# Altium project 汉中遥控器.PrjPcb
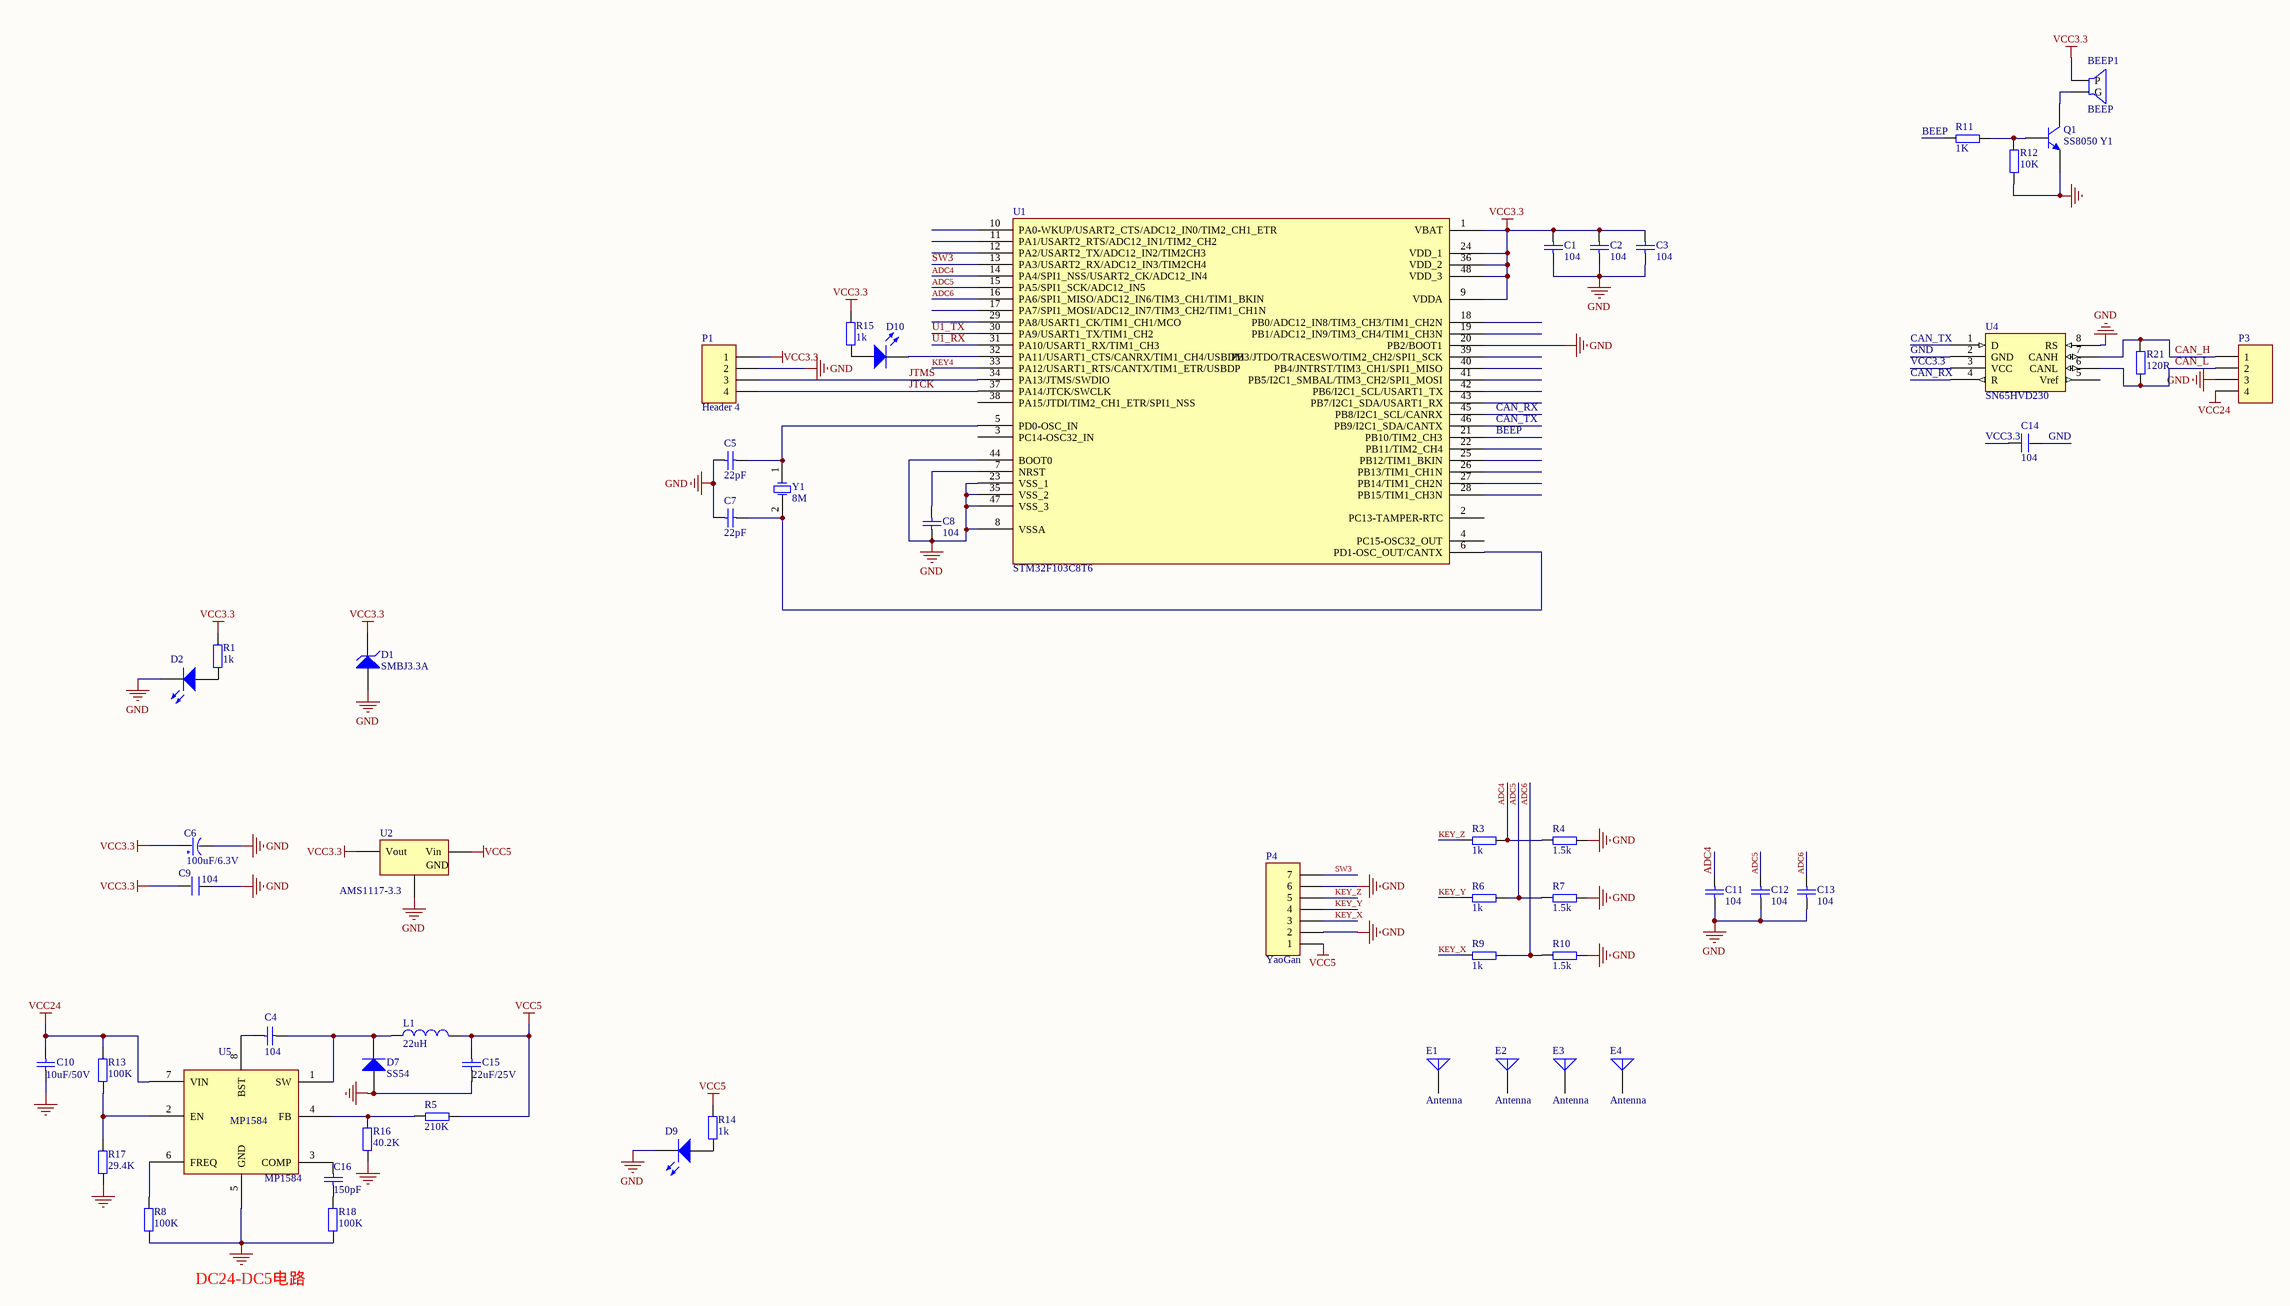
[diagram p0: Sheet2.SchDoc]
1 sheet, 54 parts. Net scope: global (net labels, ports and power ports of the same name join across sheets).
Board file: PCB2.PcbDoc

## Sheet Sheet2.SchDoc
size A2

### Parts
BEEP1  BEEP  [BELL-5]
C1  104  [0805_C]
C2  104  [0805_C]
C3  104  [0805_C]
C4  104  [0603_C]
C5  22pF  [0805_C]
C6  100uF/6.3V  [CASE-B_3528]
C7  22pF  [0805_C]
C8  104  [0805_C]
C9  104  [0805_C]
C10  10uF/50V  [1206_C]
C11  104  [0805_C]
C12  104  [0805_C]
C13  104  [0805_C]
C14  104  [0603_C]
C15  22uF/25V  [0805_C]
C16  150pF  [0603_C]
D1  SMBJ3.3A  [SMB(DO-214AA)_S1]
D2  LED0  [LC-0805_LED_S1]  (value not drawn)
D7  SS54  [SMA(DO-214AC)_S1]
D9  LED0  [LC-0805_LED_S1]  (value not drawn)
D10  LED0  [LC-0805_LED_S1]  (value not drawn)
E1  Antenna  [定位孔 Φ3.2]
E2  Antenna  [定位孔 Φ3.2]
E3  Antenna  [定位孔 Φ3.2]
E4  Antenna  [定位孔 Φ3.2]
L1  22uH  [L-7*7*4mm-S]
P1  Header 4  [IDE4]
P3  (no value)  [DZ-4-3.5]
P4  YaoGan  [XH7]
Q1  SS8050 Y1  [SOT-23(SOT-23-3)]
R1  1k  [0603_R]
R3  1k  [0603_R]
R4  1.5k  [0603_R]
R5  210K  [0603_R]
R6  1k  [0603_R]
R7  1.5k  [0603_R]
R8  100K  [0603_R]
R9  1k  [0603_R]
R10  1.5k  [0603_R]
R11  1K  [0805_R]
R12  10K  [0805_R]
R13  100K  [0603_R]
R14  1k  [0603_R]
R15  1k  [0603_R]
R16  40.2K  [0603_R]
R17  29.4K  [0603_R]
R18  100K  [0603_R]
R21  120R  [0603_R]
U1  STM32F103C8T6  [LQFP-48_7x7x05P]
U2  AMS1117-3.3  [SOT-223]
U4  SN65HVD230  [LC-SOIC-8_150mil]
U5  MP1584  [LC-SOIC-8_EP_150MIL]
Y1  8M  [XTAL_US]

### Nets
GND: C1.2 C2.2 C3.2 C5.2 C6.2(GND) C7.2 C8.2 C9.1 C10.2 C11.1 C12.2 C13.2 C14.2 C15.1 D1.1(A) D2.K D7.1(A) D9.K P1.2 P3.3 P4.2 P4.6 Q1.2(E) R4.2 R7.2 R8.2 R10.2 R12.1 R16.2 R17.2 R18.2 U1.8(VSSA) U1.20(PB2/BOOT1) U1.23(VSS_1) U1.35(VSS_2) U1.44(BOOT0) U1.47(VSS_3) U2.1(GND) U4.2(GND) U4.8(RS) U5.5(GND)
VCC3.3: BEEP1.1(P) C1.1 C2.1 C3.1 C6.1(VCC) C9.2 C14.1 D1.2(K) P1.1 R1.1 R15.1 U1.1(VBAT) U1.9(VDDA) U1.24(VDD_1) U1.36(VDD_2) U1.48(VDD_3) U2.2(Vout) U4.3(VCC)
VCC5: C15.2 L1.2 P4.1 R5.2 R14.1 U2.3(Vin)
VCC24: C10.1 P3.4 R13.1 U5.7(VIN)
ADC4: C11.2 R3.2 R4.1 U1.14(PA4/SPI1_NSS/USART2_CK/ADC12_IN4)
ADC5: C12.1 R6.2 R7.1 U1.15(PA5/SPI1_SCK/ADC12_IN5)
ADC6: C13.1 R9.2 R10.1 U1.16(PA6/SPI1_MISO/ADC12_IN6/TIM3_CH1/TIM1_BKIN)
BEEP: R11.1 U1.21(PB10/TIM2_CH3)
CAN_H: P3.1 R21.2 U4.7(CANH)
CAN_L: P3.2 R21.1 U4.6(CANL)
CAN_RX: U1.45(PB8/I2C1_SCL/CANRX) U4.4(R)
CAN_TX: U1.46(PB9/I2C1_SDA/CANTX) U4.1(D)
JTCK: P1.4 U1.37(PA14/JTCK/SWCLK)
JTMS: P1.3 U1.34(PA13/JTMS/SWDIO)
KEY4: U1.33(PA12/USART1_RTS/CANTX/TIM1_ETR/USBDP)
KEY_X: P4.3 R9.1
KEY_Y: P4.4 R6.1
KEY_Z: P4.5 R3.1
SW3: P4.7 U1.13(PA3/USART2_RX/ADC12_IN3/TIM2CH4)
U1_RX: U1.31(PA10/USART1_RX/TIM1_CH3)
U1_TX: U1.30(PA9/USART1_TX/TIM1_CH2)
NetBEEP1_2: BEEP1.2(G) Q1.3(C)
NetC4_1: C4.1 D7.2(K) L1.1 U5.1(SW)
NetC4_2: C4.2 U5.8(BST)
NetC5_1: C5.1 U1.5(PD0-OSC_IN) Y1.1(OSC1)
NetC7_1: C7.1 U1.6(PD1-OSC_OUT/CANTX) Y1.2(OSC2)
NetC8_1: C8.1 U1.7(NRST)
NetC16_1: C16.1 R18.1
NetC16_2: C16.2 U5.3(COMP)
NetD2_A: D2.A R1.2
NetD9_A: D9.A R14.2
NetD10_A: D10.A R15.2
NetD10_K: D10.K U1.32(PA11/USART1_CTS/CANRX/TIM1_CH4/USBDM)
NetQ1_1: Q1.1(B) R11.2 R12.2
NetR5_1: R5.1 R16.1 U5.4(FB)
NetR8_1: R8.1 U5.6(FREQ)
NetR13_2: R13.2 R17.1 U5.2(EN)

Not connected (* = marked no-connect by the designer): E1 1(A); E2 1(A); E3 1(A); E4 1(A); U1 2(PC13-TAMPER-RTC) 3(PC14-OSC32_IN) 4(PC15-OSC32_OUT) 10(PA0-WKUP/USART2_CTS/ADC12_IN0/TIM2_CH1_ETR) 11(PA1/USART2_RTS/ADC12_IN1/TIM2_CH2) 12(PA2/USART2_TX/ADC12_IN2/TIM2CH3) 17(PA7/SPI1_MOSI/ADC12_IN7/TIM3_CH2/TIM1_CH1N) 18(PB0/ADC12_IN8/TIM3_CH3/TIM1_CH2N) 19(PB1/ADC12_IN9/TIM3_CH4/TIM1_CH3N) 22(PB11/TIM2_CH4) 25(PB12/TIM1_BKIN) 26(PB13/TIM1_CH1N) 27(PB14/TIM1_CH2N) 28(PB15/TIM1_CH3N) 29(PA8/USART1_CK/TIM1_CH1/MCO) 38(PA15/JTDI/TIM2_CH1_ETR/SPI1_NSS) 39(PB3/JTDO/TRACESWO/TIM2_CH2/SPI1_SCK) 40(PB4/JNTRST/TIM3_CH1/SPI1_MISO) 41(PB5/I2C1_SMBAL/TIM3_CH2/SPI1_MOSI) 42(PB6/I2C1_SCL/USART1_TX) 43(PB7/I2C1_SDA/USART1_RX); U4 5(Vref)

### Notes on the sheet
- DC24-DC5电路

### Library data of the parts
C1-C3 C7 C8 C11-C13 = Cap: Capacitor; Published: 8-Jun-2000; LatestRevisionDate: 17-Jul-2002; LatestRevisionNote: Re-released for DXP Platform.; PackageReference: RAD-0.3; Publisher: Altium Limited; PackageDescription: Radial Cap, Thru-Hole; 2 Leads; 0.3 in Pin Spacing
  C1-C3 C8 C11-C13: Value: 104
  C7: Value: 22pF
C4 C10 C16 = Cap Semi: Capacitor (Semiconductor SIM Model); Published: 8-Jun-2000; LatestRevisionDate: 29-May-2009; LatestRevisionNote: IPC-7351 Footprint Added.; PackageReference: C1206; Publisher: Altium Limited; PackageDescription: Chip Capacitor
  C4: Value: 104
  C10: Value: 10uF/50V
  C16: Value: 150pF
C5 = Cap: Capacitor; Value: 22p; Published: 8-Jun-2000; LatestRevisionDate: 17-Jul-2002; LatestRevisionNote: Re-released for DXP Platform.; PackageReference: RAD-0.3; Publisher: Altium Limited; PackageDescription: Radial Cap, Thru-Hole; 2 Leads; 0.3 in Pin Spacing
C6 = CAP
C9 = C
C14 = C_3
C15 = Cap Semi: Capacitor (Semiconductor SIM Model); Value: 22uF/16V; Published: 8-Jun-2000; LatestRevisionDate: 29-May-2009; LatestRevisionNote: IPC-7351 Footprint Added.; PackageReference: C1206; Publisher: Altium Limited; PackageDescription: Chip Capacitor
D1 = D Zener: Zener Diode; Published: 8-Jun-2000; LatestRevisionDate: 17-Jul-2002; LatestRevisionNote: Re-released for DXP Platform.; PackageReference: DIODE-0.7; Publisher: Altium Limited; PackageDescription: Diode, Thru-Hole; 2 Leads; 0.7 in Pin Spacing
D2 D9 D10 = LED0: Typical INFRARED GaAs LED; Published: 8-Jun-2000; LatestRevisionDate: 08-Jul-2005; LatestRevisionNote: Mech Layer 1 removed.; PackageReference: LED-0; Publisher: Altium Limited; PackageDescription: LED; 2 Leads
D7 = SMA(DO-214AC) SS54: 二极管; ComponentLink1Description: 供应商链接; ComponentLink1URL: http://www.szlcsc.com/product/details_23178.html; Package: SMA(DO-214AC); Supplier: LC; SuppliersPartNumber: C22452
E1-E4 = Antenna: Generic Antenna; Published: 24-Mar-1999; LatestRevisionDate: 17-Jul-2002; LatestRevisionNote: Re-released for DXP Platform.; PackageReference: PIN1; Publisher: Altium Limited
L1 = Inductor: Code_IEC: 1005; Published: 8-Jun-2000; LatestRevisionDate: 29-May-2009; LatestRevisionNote: IPC-7351 Footprint Added.; PackageReference: 0402-A; Publisher: Altium Limited; PackageDescription: Chip Inductor; Code_JEITA: 0402; Value: 22uH
P1 P3 = Header 4: Header, 4-Pin; LatestRevisionDate: 17-Jul-2002; LatestRevisionNote: Re-released for DXP Platform.; Publisher: Altium Limited
P4 = Header 7: Header, 7-Pin; LatestRevisionDate: 17-Jul-2002; LatestRevisionNote: Re-released for DXP Platform.; Publisher: Altium Limited
Q1 = SOT-23 SS8050 Y1: 三极管; ComponentLink1Description: 供应商链接; ComponentLink1URL: http://www.szlcsc.com/product/details_2507.html; Package: SOT-23; Supplier: LC; SuppliersPartNumber: C2150
R1 R3-R10 R13-R18 R21 = R_2
R11 R12 = R
U1 = stm32f103v8t6
U2 = SOT-223 AMS1117-3.3: 低压差线性稳压(LDO); ComponentLink1Description: 供应商链接; ComponentLink1URL: http://www.szlcsc.com/product/details_6652.html; Package: SOT-223; Supplier: LC; SuppliersPartNumber: C6186
U4 = SN65HVD230D
U5 = MP1584EN
Y1 = XTAL: Crystal Oscillator; Published: 8-Jun-2000; LatestRevisionDate: 17-Jul-2002; LatestRevisionNote: Re-released for DXP Platform.; PackageReference: R38; Publisher: Altium Limited; PackageDescription: Crystal, Thru-Hole; 2 Leads; Body 3.1 x 8.2 mm (Dia.xH)